# EasyEDA Pro project ProPrj_MiniFoc_AT32F435.epro, board 功率板
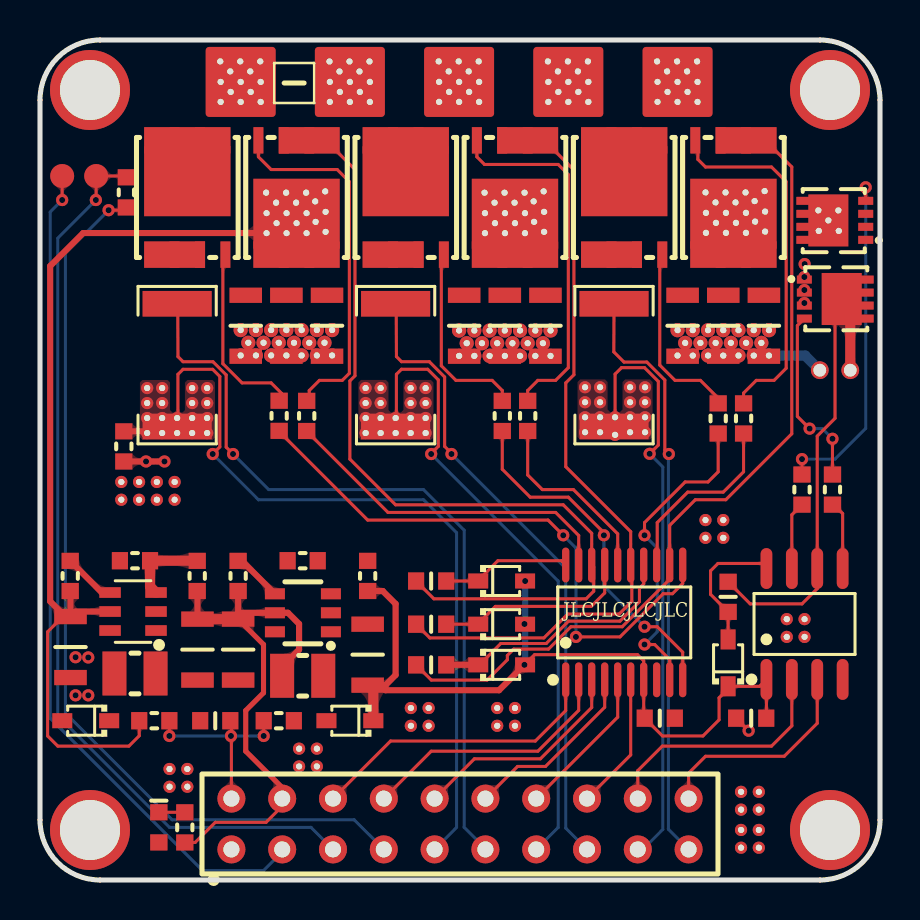
[diagram p3: board, top side]
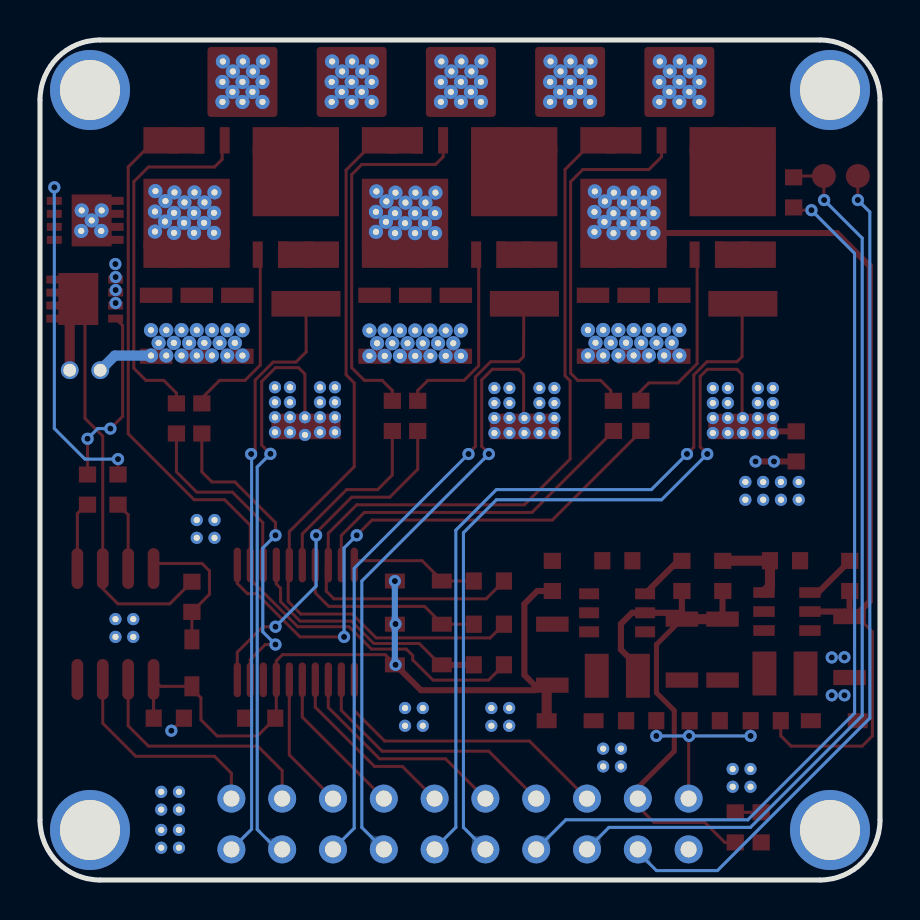
[diagram p4: board, bottom side, seen from below]

Outline 42 x 42 mm; copper layers: Top Layer, Bottom Layer. Coordinates in mm from the lower left corner of the outline.
Outline path: 0,39 0,3 arc(0.88,0.88) 3,0 39,0 arc(41.12,0.88) 42,3 42,39 arc(41.12,41.12) 39,42 3,42 arc(0.88,41.12) 0,39
Stack: Top Layer 0.035mm / Dielectric1 1.51mm FR4 er 4.5 / Bottom Layer 0.035mm

## Design rules (mm)
template: 自定义配置
spacing copperThickness1oz (default): track to track 0.127, other pairs 0 to 0.127
track width copperThickness1oz (default): min 0.127, default 0.254, max 2.54
track width copperThickness2oz: min 0.203, default 0.254, max 2.54
differential pair differentialPair (default): width min 0.127, default 0.254, max 2.54; gap min 0.152, default 0.152
via viaSize (default): diameter min 0.5, default 0.61, max 10; hole min 0.3, default 0.305, max 6.299

## Placement (name value [footprint] x y rotation side)
C2  10uF  [C0603_SMALL]  30.99 8.09 0 top
C3  1uF  [C0603_SMALL]  19.56 10.76 0 top
C4  22uF  [C1206_SMALL]  16.38 11.27 270 top
C5  22uF  [C1206_SMALL]  9.91 11.52 90 top
C8  10uF  [C1206_SMALL]  12.32 27.71 90 top
C9  1uF  [C0603_SMALL]  8.76 7.96 0 top
C11  1uF  [C0603_SMALL]  19.56 14.95 0 top
C12  1uF  [C0603_SMALL]  19.56 12.79 0 top
C20  10uF  [C1206_SMALL]  7.87 11.52 90 top
C25  10uF  [C1206_SMALL]  10.29 27.71 90 top
C27  4.7uF  [C1206_SMALL]  1.52 11.65 90 top
C28  10uF  [C1206_SMALL]  34.16 27.71 90 top
C29  1uF  [C0603_SMALL]  34.41 14.16 270 top
C30  0.1uF  [C0603_SMALL]  35.56 8.09 180 top
C31  10uF  [C1206_SMALL]  25.27 27.71 90 top
C32  10uF  [C1206_SMALL]  36.19 27.71 90 top
C33  10uF  [C1206_SMALL]  14.35 27.71 90 top
C34  10uF  [C1206_SMALL]  32.13 27.71 90 top
C35  10uF  [C1206_SMALL]  23.24 27.71 90 top
C36  10uF  [C1206_SMALL]  21.21 27.71 90 top
D2  1N5819WS  [SOD-323_L1.8-W1.3-LS2.5-RD]  23.08 12.79 0 top
D3  1N5819WS  [SOD-323_L1.8-W1.3-LS2.5-RD]  23.08 14.95 0 top
D5  1N5819WS  [SOD-323_L1.8-W1.3-LS2.5-RD]  23.08 10.76 0 top
D6  1N5819WS  [SOD-323_L1.8-W1.3-LS2.5-RD]  15.49 7.96 180 top
D7  1N5819WS  [SOD-323_L1.8-W1.3-LS2.5-RD]  2.29 7.96 180 top
D8  1N5819WS  [SOD-323_L1.8-W1.3-LS2.5-RD]  34.41 10.86 90 top
L1  10uH  [IND-SMD_L2.5-W2.0]  13.13 10.21 180 top
L2  10uH  [IND-SMD_L2.5-W2.0]  4.75 10.33 180 top
LED2  NCD0603B1  [LED0603_RED_SMALL]  5.94 2.63 270 top
NOREF  -  [Pad_e977]  10.03 38.9 0 top
NOREF#2  -  [Pad_e147]  12.95 5.68 0 top
NOREF#3  -  [Pad_e574]  7.61 22.35 0 top
NOREF#4  -  [Pad_e166]  22.86 7.71 0 top
NOREF#5  -  [Pad_e845]  14.28 33.41 0 top
NOREF#6  -  [Pad_e185]  33.27 17.11 0 top
NOREF#7  -  [Pad_e883]  34.28 34.38 0 top
NOREF#8  -  [Pad_e838]  12.33 32.34 0 top
NOREF#9  -  [Pad_e1525]  36.45 27.49 0 top
NOREF#10  -  [Pad_e971]  10.01 40.93 0 top
NOREF#11  -  [Pad_e693]  29.5 24.64 0 top
NOREF#12  -  [Pad_e150]  19.43 8.6 0 top
NOREF#13  -  [Pad_e989]  14.49 38.91 0 top
NOREF#14  -  [Pad_e1030]  32.36 40.43 0 top
NOREF#15  -  [Pad_e1523]  34.93 26.22 0 top
NOREF#16  -  [Pad_e179]  38.23 13.04 0 top
NOREF#17  -  [Pad_e151]  18.54 7.71 0 top
NOREF#18  -  [Pad_e716]  28.75 23.14 0 top
NOREF#19  -  [Pad_e495]  2.5 2.5 180 top
NOREF#20  -  [Pad_e125]  4.95 19.9 0 top
NOREF#21  -  [Pad_e837]  13.33 32.34 0 top
NOREF#22  -  [Pad_e2079]  39.92 33.48 0 top
NOREF#23  -  [Pad_e1500]  24 27.47 0 top
NOREF#24  -  [Pad_e638]  17.03 24.6 0 top
NOREF#25  -  [Pad_e867]  25.18 34.43 0 top
NOREF#26  -  [Pad_e853]  24.7 32.91 0 top
NOREF#27  -  [Pad_e878]  33.8 32.86 0 top
NOREF#28  -  [Pad_e134]  6.48 4.66 0 top
NOREF#29  -  [Pad_e1489]  21.72 27.47 0 top
NOREF#30  -  [Pad_e839]  12.83 32.84 0 top
NOREF#31  -  [Pad_e623]  17.78 22.35 0 top
NOREF#32  -  [Pad_e2076]  39.42 32.98 0 top
NOREF#33  -  [Pad_e1513]  31.88 26.22 0 top
NOREF#34  -  [Pad_e835]  13.78 32.91 0 top
NOREF#35  -  [Pad_e1021]  27.42 38.9 0 top
NOREF#36  -  [Pad_e625]  16.28 22.35 0 top
NOREF#37  -  [Pad_e1522]  35.31 26.86 0 top
NOREF#38  -  [Pad_e1484]  13.84 27.5 0 top
NOREF#39  -  [Pad_e1009]  25.39 40.93 0 top
NOREF#40  -  [Pad_e632]  16.28 23.85 0 top
NOREF#41  -  [Pad_e177]  35.94 1.61 0 top
NOREF#42  -  [Pad_e854]  25.2 32.41 0 top
NOREF#43  -  [Pad_e1518]  33.78 26.86 0 top
NOREF#44  -  [Pad_e852]  12.8 33.87 0 top
NOREF#45  -  [Pad_e133]  7.37 5.55 0 top
NOREF#46  -  [Pad_e182]  33.27 18 0 top
NOREF#47  -  [Pad_e1003]  20.96 38.9 0 top
NOREF#48  -  [Pad_e993]  16.47 40.93 0 top
NOREF#49  -  [Pad_e1029]  31.88 38.9 0 top
NOREF#50  -  [Pad_e1016]  26.42 38.9 0 top
NOREF#51  -  [Pad_e841]  12.33 33.34 0 top
NOREF#52  -  [Pad_e858]  24.25 33.34 0 top
NOREF#53  -  [Pad_e874]  34.3 32.36 0 top
NOREF#54  -  [Pad_e631]  19.28 23.85 0 top
NOREF#55  -  [Pad_e872]  36.25 32.42 0 top
NOREF#56  -  [Pad_e860]  22.75 32.84 0 top
NOREF#57  -  [Pad_e494]  39.5 2.5 180 top
NOREF#58  -  [Pad_e1498]  22.86 26.84 0 top
NOREF#59  -  [Pad_e1005]  21.46 39.4 0 top
NOREF#60  -  [Pad_e500]  20.96 39.9 0 top
NOREF#61  -  [Pad_e493]  39.5 39.5 180 top
NOREF#62  -  [Pad_e169]  35.05 4.41 0 top
NOREF#63  -  [Pad_e719]  28 24.64 0 top
NOREF#64  -  [Pad_e857]  23.75 32.84 0 top
NOREF#65  -  [Pad_e861]  22.25 32.34 0 top
NOREF#66  -  [Pad_e1507]  24.76 26.2 0 top
NOREF#67  -  [Pad_e637]  16.28 24.6 0 top
NOREF#68  -  [Pad_e698]  30.25 22.39 0 top
NOREF#69  -  [Pad_e629]  18.53 23.1 0 top
NOREF#70  -  [Pad_e127]  4.95 19.01 0 top
NOREF#71  -  [Pad_e592]  6.11 24.6 0 top
NOREF#72  -  [Pad_e1519]  34.16 26.22 0 top
NOREF#73  -  [Pad_e864]  24.23 34.37 0 top
NOREF#74  -  [Pad_e697]  30.25 23.89 0 top
NOREF#75  -  [Pad_e1520]  34.93 27.49 0 top
NOREF#76  -  [Pad_e1015]  25.42 38.91 0 top
NOREF#77  -  [Pad_e1023]  31.86 40.93 0 top
NOREF#78  -  [Pad_e636]  18.53 24.6 0 top
NOREF#79  -  [Pad_e1494]  21.72 26.2 0 top
NOREF#80  -  [Pad_e884]  33.28 34.38 0 top
NOREF#81  -  [Pad_e627]  18.53 22.35 0 top
NOREF#82  -  [Pad_e132]  6.48 5.55 0 top
NOREF#83  -  [Pad_e973]  9.03 39.91 0 top
NOREF#84  -  [Pad_e871]  35.75 32.92 0 top
NOREF#85  -  [Pad_e851]  13.76 33.93 0 top
NOREF#86  -  [Pad_e167]  23.75 7.71 0 top
NOREF#87  -  [Pad_e983]  14.47 40.93 0 top
NOREF#88  -  [Pad_e1472]  11.18 26.86 0 top
NOREF#89  -  [Pad_e1476]  11.56 27.5 0 top
NOREF#90  -  [Pad_e869]  24.68 33.93 0 top
NOREF#91  -  [Pad_e1477]  12.32 27.5 0 top
NOREF#92  -  [Pad_e1018]  26.92 39.4 0 top
NOREF#93  -  [Pad_e1011]  25.89 40.43 0 top
NOREF#94  -  [Pad_e1503]  24 26.2 0 top
NOREF#95  -  [Pad_e1479]  12.32 26.23 0 top
NOREF#96  -  [Pad_e152]  19.43 7.71 0 top
NOREF#97  -  [Pad_e715]  27.25 23.14 0 top
NOREF#98  -  [Pad_e877]  34.3 33.36 0 top
NOREF#99  -  [Pad_e880]  33.3 33.36 0 top
NOREF#100  -  [Pad_e988]  14.99 39.4 0 top
NOREF#101  -  [Pad_e171]  35.94 4.41 0 top
NOREF#102  -  [Pad_e1471]  10.41 26.86 0 top
NOREF#103  -  [Pad_e1001]  20.46 39.4 0 top
NOREF#104  -  [Pad_e1013]  26.42 39.9 0 top
NOREF#105  -  [Pad_e1495]  22.48 26.2 0 top
NOREF#106  -  [Pad_e176]  35.05 1.61 0 top
NOREF#107  -  [Pad_e1528]  36.45 26.22 0 top
NOREF#108  -  [Pad_e1527]  35.69 26.22 0 top
NOREF#109  -  [Pad_e628]  17.03 23.1 0 top
NOREF#110  -  [Pad_e696]  30.25 24.64 0 top
NOREF#111  -  [Pad_e1007]  21.96 39.9 0 top
NOREF#112  -  [Pad_e149]  18.54 8.6 0 top
NOREF#113  -  [Pad_e619]  17.78 23.1 0 top
NOREF#114  -  [Pad_e987]  15.49 39.9 0 top
NOREF#115  -  [Pad_e710]  27.25 23.89 0 top
NOREF#116  -  [Pad_e712]  28.75 22.26 0 top
NOREF#117  -  [Pad_e981]  11.03 39.9 0 top
NOREF#118  -  [Pad_e1517]  34.16 27.49 0 top
NOREF#119  -  [Pad_e711]  28 23.89 0 top
NOREF#120  -  [Pad_e994]  16.49 39.9 0 top
NOREF#121  -  [Pad_e836]  14.28 32.41 0 top
NOREF#122  -  [Pad_e633]  18.53 23.85 0 top
NOREF#123  -  [Pad_e1470]  10.03 27.5 0 top
NOREF#124  -  [Pad_e843]  11.33 32.34 0 top
NOREF#125  -  [Pad_e2078]  39.94 32.45 0 top
NOREF#126  -  [Pad_e1006]  21.93 40.93 0 top
NOREF#127  -  [Pad_e984]  15.47 40.93 0 top
NOREF#128  -  [Pad_e1508]  25.53 26.2 0 top
NOREF#129  -  [Pad_e1031]  32.38 39.4 0 top
NOREF#130  -  [Pad_e501]  15.49 39.9 180 top
NOREF#131  -  [Pad_e178]  37.34 13.04 0 top
NOREF#132  -  [Pad_e162]  23.75 8.6 0 top
NOREF#133  -  [Pad_e617]  16.28 23.1 0 top
NOREF#134  -  [Pad_e1707]  40.51 25.49 0 top
NOREF#135  -  [Pad_e148]  13.84 5.68 0 top
NOREF#136  -  [Pad_e1024]  31.36 40.43 0 top
NOREF#137  -  [Pad_e1496]  22.48 27.47 0 top
NOREF#138  -  [Pad_e976]  9.03 38.91 0 top
NOREF#139  -  [Pad_e846]  13.31 34.37 0 top
NOREF#140  -  [Pad_e694]  29.5 22.39 0 top
NOREF#141  -  [Pad_e1493]  20.96 26.2 0 top
NOREF#142  -  [Pad_e572]  5.36 22.35 0 top
NOREF#143  -  [Pad_e499]  26.42 39.9 180 top
NOREF#144  -  [Pad_e996]  19.93 40.93 0 top
NOREF#145  -  [Pad_e1000]  20.96 39.9 0 top
NOREF#146  -  [Pad_e1516]  33.4 27.49 0 top
NOREF#147  -  [Pad_e1028]  30.88 38.91 0 top
NOREF#148  -  [Pad_e129]  6.73 19.9 0 top
NOREF#149  -  [Pad_e576]  7.61 23.1 0 top
NOREF#150  -  [Pad_e1502]  24.38 26.84 0 top
NOREF#151  -  [Pad_e593]  8.36 24.6 0 top
NOREF#152  -  [Pad_e1705]  38.99 25.49 0 top
NOREF#153  -  [Pad_e639]  19.28 24.6 0 top
NOREF#154  -  [Pad_e183]  34.16 18 0 top
NOREF#155  -  [Pad_e130]  5.84 19.01 0 top
NOREF#156  -  [Pad_e1033]  32.88 39.9 0 top
NOREF#157  -  [Pad_e1022]  30.86 40.93 0 top
NOREF#158  -  [Pad_e1034]  32.88 38.9 0 top
NOREF#159  -  [Pad_e590]  7.61 24.6 0 top
NOREF#160  -  [Pad_e717]  28 23.14 0 top
NOREF#161  -  [Pad_e566]  6.86 23.1 0 top
NOREF#162  -  [Pad_e1025]  30.88 39.91 0 top
NOREF#163  -  [Pad_e1012]  25.42 39.91 0 top
NOREF#164  -  [Pad_e186]  34.16 17.11 0 top
NOREF#165  -  [Pad_e585]  8.36 23.85 0 top
NOREF#166  -  [Pad_e1002]  19.95 38.91 0 top
NOREF#167  -  [Pad_e1488]  14.6 26.23 0 top
NOREF#168  -  [Pad_e995]  16.49 38.9 0 top
NOREF#169  -  [Pad_e699]  30.25 23.14 0 top
NOREF#170  -  [Pad_e1020]  27.42 39.9 0 top
NOREF#171  -  [Pad_e1487]  13.84 26.23 0 top
NOREF#172  -  [Pad_e1526]  36.07 26.86 0 top
NOREF#173  -  [Pad_e1491]  21.34 26.84 0 top
NOREF#174  -  [Pad_e1492]  22.1 26.84 0 top
NOREF#175  -  [Pad_e1509]  32.64 27.49 0 top
NOREF#176  -  [Pad_e863]  25.2 33.41 0 top
NOREF#177  -  [Pad_e1483]  13.08 26.23 0 top
NOREF#178  -  [Pad_e618]  19.28 23.1 0 top
NOREF#179  -  [Pad_e888]  34.78 33.88 0 top
NOREF#180  -  [Pad_e997]  20.93 40.93 0 top
NOREF#181  -  [Pad_e865]  23.23 34.37 0 top
NOREF#182  -  [Pad_e2075]  38.92 33.48 0 top
NOREF#183  -  [Pad_e571]  6.11 22.35 0 top
NOREF#184  -  [Pad_e980]  11.01 40.93 0 top
NOREF#185  -  [Pad_e175]  35.94 2.5 0 top
NOREF#186  -  [Pad_e998]  20.43 40.43 0 top
NOREF#187  -  [Pad_e492]  2.5 39.5 180 top
NOREF#188  -  [Pad_e870]  23.73 33.87 0 top
NOREF#189  -  [Pad_e881]  36.25 33.42 0 top
NOREF#190  -  [Pad_e859]  23.25 33.34 0 top
NOREF#191  -  [Pad_e575]  6.11 23.1 0 top
NOREF#192  -  [Pad_e1019]  27.39 40.93 0 top
NOREF#193  -  [Pad_e1524]  35.69 27.49 0 top
NOREF#194  -  [Pad_e849]  14.26 34.43 0 top
NOREF#195  -  [Pad_e1505]  25.53 27.47 0 top
NOREF#196  -  [Pad_e887]  35.73 33.94 0 top
NOREF#197  -  [Pad_e1506]  25.15 26.84 0 top
NOREF#198  -  [Pad_e886]  33.78 33.88 0 top
NOREF#199  -  [Pad_e1469]  10.79 27.5 0 top
NOREF#200  -  [Pad_e1481]  12.7 26.86 0 top
NOREF#201  -  [Pad_e985]  14.97 40.43 0 top
NOREF#202  -  [Pad_e2077]  38.94 32.45 0 top
NOREF#203  -  [Pad_e879]  33.3 32.36 0 top
NOREF#204  -  [Pad_e128]  5.84 19.9 0 top
NOREF#205  -  [Pad_e180]  37.34 12.16 0 top
NOREF#206  -  [Pad_e999]  19.95 39.91 0 top
NOREF#207  -  [Pad_e862]  22.25 33.34 0 top
NOREF#208  -  [Pad_e855]  24.25 32.34 0 top
NOREF#209  -  [Pad_e498]  10.03 39.9 0 top
NOREF#210  -  [Pad_e174]  35.05 2.5 0 top
NOREF#211  -  [Pad_e1504]  24.76 27.47 0 top
NOREF#212  -  [Pad_e1511]  32.26 26.86 0 top
NOREF#213  -  [Pad_e587]  7.61 23.85 0 top
NOREF#214  -  [Pad_e140]  12.95 6.57 0 top
NOREF#215  -  [Pad_e873]  35.3 32.36 0 top
NOREF#216  -  [Pad_e974]  10.03 39.9 0 top
NOREF#217  -  [Pad_e970]  9.01 40.93 0 top
NOREF#218  -  [Pad_e564]  5.36 23.1 0 top
NOREF#219  -  [Pad_e161]  22.86 8.6 0 top
NOREF#220  -  [Pad_e588]  6.11 23.85 0 top
NOREF#221  -  [Pad_e1514]  32.64 26.22 0 top
NOREF#222  -  [Pad_e1485]  14.6 27.5 0 top
NOREF#223  -  [Pad_e982]  11.03 38.9 0 top
NOREF#224  -  [Pad_e844]  11.33 33.34 0 top
NOREF#225  -  [Pad_e124]  4.06 19.9 0 top
NOREF#226  -  [Pad_e1004]  21.43 40.43 0 top
NOREF#227  -  [Pad_e986]  14.49 39.91 0 top
NOREF#228  -  [Pad_e714]  28 22.39 0 top
NOREF#229  -  [Pad_e992]  15.99 39.4 0 top
NOREF#230  -  [Pad_e135]  7.37 4.66 0 top
NOREF#231  -  [Pad_e502]  31.88 39.9 0 top
NOREF#232  -  [Pad_e1499]  23.24 26.2 0 top
NOREF#233  -  [Pad_e972]  9.51 40.43 0 top
NOREF#234  -  [Pad_e172]  35.05 3.52 0 top
NOREF#235  -  [Pad_e1032]  32.86 40.93 0 top
NOREF#236  -  [Pad_e1017]  26.89 40.43 0 top
NOREF#237  -  [Pad_e979]  10.53 39.4 0 top
NOREF#238  -  [Pad_e565]  8.36 23.1 0 top
NOREF#239  -  [Pad_e840]  13.33 33.34 0 top
NOREF#240  -  [Pad_e624]  17.03 22.35 0 top
NOREF#241  -  [Pad_e1027]  31.38 39.4 0 top
NOREF#242  -  [Pad_e876]  35.3 33.36 0 top
NOREF#243  -  [Pad_e975]  9.53 39.4 0 top
NOREF#244  -  [Pad_e868]  22.73 33.87 0 top
NOREF#245  -  [Pad_e1475]  11.56 26.23 0 top
NOREF#246  -  [Pad_e573]  8.36 22.35 0 top
NOREF#247  -  [Pad_e718]  27.25 24.64 0 top
NOREF#248  -  [Pad_e1014]  25.92 39.4 0 top
NOREF#249  -  [Pad_e1490]  20.96 27.47 0 top
NOREF#250  -  [Pad_e692]  29.5 23.14 0 top
NOREF#251  -  [Pad_e866]  22.23 34.37 0 top
NOREF#252  -  [Pad_e1010]  26.39 40.93 0 top
NOREF#253  -  [Pad_e1480]  13.08 27.5 0 top
NOREF#254  -  [Pad_e1474]  10.79 26.23 0 top
NOREF#255  -  [Pad_e850]  11.8 33.87 0 top
NOREF#256  -  [Pad_e842]  11.83 32.84 0 top
NOREF#257  -  [Pad_e882]  35.28 34.38 0 top
NOREF#258  -  [Pad_e1473]  10.03 26.23 0 top
NOREF#259  -  [Pad_e131]  6.73 19.01 0 top
NOREF#260  -  [Pad_e1486]  14.22 26.86 0 top
NOREF#261  -  [Pad_e591]  5.36 24.6 0 top
NOREF#262  -  [Pad_e875]  34.8 32.86 0 top
NOREF#263  -  [Pad_e848]  11.3 34.37 0 top
NOREF#264  -  [Pad_e173]  35.94 3.52 0 top
NOREF#265  -  [Pad_e570]  6.86 22.35 0 top
NOREF#266  -  [Pad_e1482]  13.46 26.86 0 top
NOREF#267  -  [Pad_e126]  4.06 19.01 0 top
NOREF#268  -  [Pad_e856]  23.25 32.34 0 top
NOREF#269  -  [Pad_e885]  36.23 34.44 0 top
NOREF#270  -  [Pad_e991]  15.97 40.43 0 top
NOREF#271  -  [Pad_e695]  29.5 23.89 0 top
NOREF#272  -  [Pad_e978]  10.51 40.43 0 top
NOREF#273  -  [Pad_e1501]  23.62 26.84 0 top
NOREF#274  -  [Pad_e1497]  23.24 27.47 0 top
NOREF#275  -  [Pad_e145]  13.84 6.57 0 top
NOREF#276  -  [Pad_e1512]  33.02 26.86 0 top
NOREF#277  -  [Pad_e1478]  11.94 26.86 0 top
NOREF#278  -  [Pad_e1026]  31.88 39.9 0 top
NOREF#279  -  [Pad_e1521]  34.54 26.86 0 top
NOREF#280  -  [Pad_e626]  19.28 22.35 0 top
NOREF#281  -  [Pad_e1008]  21.96 38.9 0 top
NOREF#282  -  [Pad_e990]  15.49 38.9 0 top
NOREF#283  -  [Pad_e181]  38.23 12.16 0 top
NOREF#284  -  [Pad_e713]  27.25 22.39 0 top
NOREF#285  -  [Pad_e1510]  31.88 27.49 0 top
NOREF#286  -  [Pad_e1515]  33.4 26.22 0 top
NOREF#287  -  [Pad_e847]  12.31 34.37 0 top
NOREF#288  -  [Pad_e634]  17.03 23.85 0 top
NOREF#289  -  [Pad_e586]  5.36 23.85 0 top
Q7  KNY3406C  [PDFNWB-8L_L6.0-W5.0-P1.27-BL-EP_CON]  34.67 34.13 180 top
Q8  KNY3406C  [PDFNWB-8L_L6.0-W5.0-P1.27-BL-EP_CON]  23.75 34.13 180 top
Q9  KNY3406C  [PDFNWB-8L_L6.0-W5.0-P1.27-BL-EP_CON]  12.83 34.13 180 top
Q10  KNY3406C  [PDFNWB-8L_L6.0-W5.0-P1.27-BL-EP_CON]  29.21 34.13 0 top
Q11  KNY3406C  [PDFNWB-8L_L6.0-W5.0-P1.27-BL-EP_CON]  18.29 34.13 0 top
Q12  KNY3406C  [PDFNWB-8L_L6.0-W5.0-P1.27-BL-EP_CON]  7.37 34.13 0 top
Q15  WSD4070DN  [PDFN3333-8_L3.1-W3.2-P0.65-LS3.4-BL]  39.75 32.98 90 top
Q16  WSD4070DN  [PDFN3333-8_L3.1-W3.2-P0.65-LS3.4-BL]  39.75 29.05 270 top
R1  10kΩ  [R0603_SMALL]  5.72 7.96 0 top
R2  5mΩ  [R2512]  6.86 25.74 90 top
R3  5mΩ  [R2512]  17.78 25.74 90 top
R5  100kΩ  [R0603_SMALL]  16.38 15.2 90 top
R6  1kΩ  [R0603_SMALL]  7.24 2.63 90 top
R7  10Ω  [R0603_SMALL]  35.18 23.08 90 top
R8  1kΩ  [R0603_SMALL]  11.94 7.96 0 top
R11  10Ω  [R0603_SMALL]  33.91 23.08 90 top
R14  5mΩ  [R2512]  28.7 25.74 90 top
R19  10Ω  [R0603_SMALL]  24.38 23.2 90 top
R22  10Ω  [R0603_SMALL]  23.11 23.2 90 top
R23  10Ω  [R0603_SMALL]  13.33 23.2 90 top
R24  10Ω  [R0603_SMALL]  11.96 23.21 90 top
R25  5.1kΩ  [R0603_SMALL]  13.13 15.96 180 top
R26  10kΩ  [R0603_SMALL]  4.75 15.96 180 top
R27  52.3kΩ  [R0603_SMALL]  7.86 15.2 90 top
R28  10kΩ  [R0603_SMALL]  9.91 15.2 90 top
R29  10kΩ  [R0603_SMALL]  1.51 15.2 90 top
R61  0Ω  [R0603_SMALL]  4.19 21.68 270 top
R62  10Ω  [R0603_SMALL]  38.1 19.52 90 top
R63  10Ω  [R0603_SMALL]  39.62 19.52 90 top
RT1  TCTR0603F10K0F3930T  [R0603_SMALL]  4.32 34.38 90 top
TP5  Testpoint 1.6mm  [TESTPOINT 1.6MM]  1.11 35.2 0 top
TP6  Testpoint 1.6mm  [TESTPOINT 1.6MM]  2.81 35.2 0 top
U1  FD6288T  [TSSOP-20_L6.5-W4.4-P0.65-LS6.4-BL]  29.21 12.88 0 top
U14  MT3608  [SOT-23-6_L2.9-W1.6-P0.95-LS2.8-BR]  13.15 13.36 0 top
U15  TX4137  [SOT-23-6_L2.9-W1.6-P0.95-LS2.8-BL]  4.65 13.42 90 top
U19  MF254V-12-20-0743  [HDR-TH_20P-P2.54-V-F-R2-C10-S2.54-3]  21 2.8 0 top
U20  EG3112  [SOIC-8_L4.9-W3.9-P1.27-LS6.0-BL]  38.23 12.8 0 top

## Footprints (pads in the part's own frame, mm; a bottom-side part is the same pattern mirrored in y, then rotated)
C0603_SMALL
  rect 0.806x0.864 smd: 1(-0.753,0) 2(0.753,0)
C1206_SMALL
  rect 0.762x1.625 smd: 1(-1.524,0) 2(1.524,0)
HDR-TH_20P-P2.54-V-F-R2-C10-S2.54-3
  round 1.4 hole 0.8: 1(-11.43,-1.27) 2(-11.43,1.27) 3(-8.89,-1.27) 4(-8.89,1.27) 5(-6.35,-1.27) 6(-6.35,1.27) 7(-3.81,-1.27) 8(-3.81,1.27) 9(-1.27,-1.27) 10(-1.27,1.27) 11(1.27,-1.27) 12(1.27,1.27) 13(3.81,-1.27) 14(3.81,1.27) 15(6.35,-1.27) 16(6.35,1.27) 17(8.89,-1.27) 18(8.89,1.27) 19(11.43,-1.27) 20(11.43,1.27)
IND-SMD_L2.5-W2.0
  rect 1.199x2.2 smd: 1(1.028,0) 2(-1.028,0)
LED0603_RED_SMALL
  rect 0.806x0.864 smd: 1(0.753,0) 2(-0.753,0)
Pad_e124
  round 0.61 hole 0.31x0.305: (0,0)
Pad_e125
  round 0.61 hole 0.31x0.305: (0,0)
Pad_e126
  round 0.61 hole 0.31x0.305: (0,0)
Pad_e127
  round 0.61 hole 0.31x0.305: (0,0)
Pad_e128
  round 0.61 hole 0.31x0.305: (0,0)
Pad_e129
  round 0.61 hole 0.31x0.305: (0,0)
Pad_e130
  round 0.61 hole 0.31x0.305: (0,0)
Pad_e131
  round 0.61 hole 0.31x0.305: (0,0)
Pad_e132
  round 0.61 hole 0.31x0.305: (0,0)
Pad_e133
  round 0.61 hole 0.31x0.305: (0,0)
Pad_e134
  round 0.61 hole 0.31x0.305: (0,0)
Pad_e135
  round 0.61 hole 0.31x0.305: (0,0)
Pad_e140
  round 0.61 hole 0.31x0.305: (0,0)
Pad_e145
  round 0.61 hole 0.31x0.305: (0,0)
Pad_e147
  round 0.61 hole 0.31x0.305: (0,0)
Pad_e148
  round 0.61 hole 0.31x0.305: (0,0)
Pad_e149
  round 0.61 hole 0.31x0.305: (0,0)
Pad_e150
  round 0.61 hole 0.31x0.305: (0,0)
Pad_e151
  round 0.61 hole 0.31x0.305: (0,0)
Pad_e152
  round 0.61 hole 0.31x0.305: (0,0)
Pad_e161
  round 0.61 hole 0.31x0.305: (0,0)
Pad_e162
  round 0.61 hole 0.31x0.305: (0,0)
Pad_e166
  round 0.61 hole 0.31x0.305: (0,0)
Pad_e167
  round 0.61 hole 0.31x0.305: (0,0)
Pad_e169
  round 0.61 hole 0.31x0.305: (0,0)
Pad_e171
  round 0.61 hole 0.31x0.305: (0,0)
Pad_e172
  round 0.61 hole 0.31x0.305: (0,0)
Pad_e173
  round 0.61 hole 0.31x0.305: (0,0)
Pad_e174
  round 0.61 hole 0.31x0.305: (0,0)
Pad_e175
  round 0.61 hole 0.31x0.305: (0,0)
Pad_e176
  round 0.61 hole 0.31x0.305: (0,0)
Pad_e177
  round 0.61 hole 0.31x0.305: (0,0)
Pad_e178
  round 0.61 hole 0.31x0.305: (0,0)
Pad_e179
  round 0.61 hole 0.31x0.305: (0,0)
Pad_e180
  round 0.61 hole 0.31x0.305: (0,0)
Pad_e181
  round 0.61 hole 0.31x0.305: (0,0)
Pad_e182
  round 0.61 hole 0.31x0.305: (0,0)
Pad_e183
  round 0.61 hole 0.31x0.305: (0,0)
Pad_e185
  round 0.61 hole 0.31x0.305: (0,0)
Pad_e186
  round 0.61 hole 0.31x0.305: (0,0)
Pad_e492
  round 4 hole 3: 1(0,0)
Pad_e493
  round 4 hole 3.005x3: 1(0,0)
Pad_e494
  round 4 hole 3.005x3: 1(0,0)
Pad_e495
  round 4 hole 3.005x3: 1(0,0)
Pad_e498
  rrect 3.5x3.5 smd: 21(0,0)
Pad_e499
  rrect 3.5x3.5 smd: 21(0,0)
Pad_e500
  rrect 3.5x3.5 smd: 21(0,0)
Pad_e501
  rrect 3.5x3.5 smd: 21(0,0)
Pad_e502
  rrect 3.5x3.5 smd: 21(0,0)
Pad_e564
  round 0.61 hole 0.31x0.305: (0,0)
Pad_e565
  round 0.61 hole 0.31x0.305: (0,0)
Pad_e566
  round 0.61 hole 0.31x0.305: (0,0)
Pad_e570
  round 0.61 hole 0.31x0.305: (0,0)
Pad_e571
  round 0.61 hole 0.31x0.305: (0,0)
Pad_e572
  round 0.61 hole 0.31x0.305: (0,0)
Pad_e573
  round 0.61 hole 0.31x0.305: (0,0)
Pad_e574
  round 0.61 hole 0.31x0.305: (0,0)
Pad_e575
  round 0.61 hole 0.31x0.305: (0,0)
Pad_e576
  round 0.61 hole 0.31x0.305: (0,0)
Pad_e585
  round 0.61 hole 0.31x0.305: (0,0)
Pad_e586
  round 0.61 hole 0.31x0.305: (0,0)
Pad_e587
  round 0.61 hole 0.31x0.305: (0,0)
Pad_e588
  round 0.61 hole 0.31x0.305: (0,0)
Pad_e590
  round 0.61 hole 0.31x0.305: (0,0)
Pad_e591
  round 0.61 hole 0.31x0.305: (0,0)
Pad_e592
  round 0.61 hole 0.31x0.305: (0,0)
Pad_e593
  round 0.61 hole 0.31x0.305: (0,0)
Pad_e617
  round 0.61 hole 0.31x0.305: (0,0)
Pad_e618
  round 0.61 hole 0.31x0.305: (0,0)
Pad_e619
  round 0.61 hole 0.31x0.305: (0,0)
Pad_e623
  round 0.61 hole 0.31x0.305: (0,0)
Pad_e624
  round 0.61 hole 0.31x0.305: (0,0)
Pad_e625
  round 0.61 hole 0.31x0.305: (0,0)
Pad_e626
  round 0.61 hole 0.31x0.305: (0,0)
Pad_e627
  round 0.61 hole 0.31x0.305: (0,0)
Pad_e628
  round 0.61 hole 0.31x0.305: (0,0)
Pad_e629
  round 0.61 hole 0.31x0.305: (0,0)
Pad_e631
  round 0.61 hole 0.31x0.305: (0,0)
Pad_e632
  round 0.61 hole 0.31x0.305: (0,0)
Pad_e633
  round 0.61 hole 0.31x0.305: (0,0)
Pad_e634
  round 0.61 hole 0.31x0.305: (0,0)
Pad_e636
  round 0.61 hole 0.31x0.305: (0,0)
Pad_e637
  round 0.61 hole 0.31x0.305: (0,0)
Pad_e638
  round 0.61 hole 0.31x0.305: (0,0)
Pad_e639
  round 0.61 hole 0.31x0.305: (0,0)
Pad_e692
  round 0.61 hole 0.31x0.305: (0,0)
Pad_e693
  round 0.61 hole 0.31x0.305: (0,0)
Pad_e694
  round 0.61 hole 0.31x0.305: (0,0)
Pad_e695
  round 0.61 hole 0.31x0.305: (0,0)
Pad_e696
  round 0.61 hole 0.31x0.305: (0,0)
Pad_e697
  round 0.61 hole 0.31x0.305: (0,0)
Pad_e698
  round 0.61 hole 0.31x0.305: (0,0)
Pad_e699
  round 0.61 hole 0.31x0.305: (0,0)
Pad_e710
  round 0.61 hole 0.31x0.305: (0,0)
Pad_e711
  round 0.61 hole 0.31x0.305: (0,0)
Pad_e712
  round 0.61 hole 0.31x0.305: (0,0)
Pad_e713
  round 0.61 hole 0.31x0.305: (0,0)
Pad_e714
  round 0.61 hole 0.31x0.305: (0,0)
Pad_e715
  round 0.61 hole 0.31x0.305: (0,0)
Pad_e716
  round 0.61 hole 0.31x0.305: (0,0)
Pad_e717
  round 0.61 hole 0.31x0.305: (0,0)
Pad_e718
  round 0.61 hole 0.31x0.305: (0,0)
Pad_e719
  round 0.61 hole 0.31x0.305: (0,0)
Pad_e835
  round 0.711 hole 0.31x0.305: (0,0)
Pad_e836
  round 0.711 hole 0.31x0.305: (0,0)
Pad_e837
  round 0.711 hole 0.31x0.305: (0,0)
Pad_e838
  round 0.711 hole 0.31x0.305: (0,0)
Pad_e839
  round 0.711 hole 0.31x0.305: (0,0)
Pad_e840
  round 0.711 hole 0.31x0.305: (0,0)
Pad_e841
  round 0.711 hole 0.31x0.305: (0,0)
Pad_e842
  round 0.711 hole 0.31x0.305: (0,0)
Pad_e843
  round 0.711 hole 0.31x0.305: (0,0)
Pad_e844
  round 0.711 hole 0.31x0.305: (0,0)
Pad_e845
  round 0.711 hole 0.31x0.305: (0,0)
Pad_e846
  round 0.711 hole 0.31x0.305: (0,0)
Pad_e847
  round 0.711 hole 0.31x0.305: (0,0)
Pad_e848
  round 0.711 hole 0.31x0.305: (0,0)
Pad_e849
  round 0.711 hole 0.31x0.305: (0,0)
Pad_e850
  round 0.711 hole 0.31x0.305: (0,0)
Pad_e851
  round 0.711 hole 0.31x0.305: (0,0)
Pad_e852
  round 0.711 hole 0.31x0.305: (0,0)
Pad_e853
  round 0.711 hole 0.31x0.305: (0,0)
Pad_e854
  round 0.711 hole 0.31x0.305: (0,0)
Pad_e855
  round 0.711 hole 0.31x0.305: (0,0)
Pad_e856
  round 0.711 hole 0.31x0.305: (0,0)
Pad_e857
  round 0.711 hole 0.31x0.305: (0,0)
Pad_e858
  round 0.711 hole 0.31x0.305: (0,0)
Pad_e859
  round 0.711 hole 0.31x0.305: (0,0)
Pad_e860
  round 0.711 hole 0.31x0.305: (0,0)
Pad_e861
  round 0.711 hole 0.31x0.305: (0,0)
Pad_e862
  round 0.711 hole 0.31x0.305: (0,0)
Pad_e863
  round 0.711 hole 0.31x0.305: (0,0)
Pad_e864
  round 0.711 hole 0.31x0.305: (0,0)
Pad_e865
  round 0.711 hole 0.31x0.305: (0,0)
Pad_e866
  round 0.711 hole 0.31x0.305: (0,0)
Pad_e867
  round 0.711 hole 0.31x0.305: (0,0)
Pad_e868
  round 0.711 hole 0.31x0.305: (0,0)
Pad_e869
  round 0.711 hole 0.31x0.305: (0,0)
Pad_e870
  round 0.711 hole 0.31x0.305: (0,0)
Pad_e871
  round 0.711 hole 0.31x0.305: (0,0)
Pad_e872
  round 0.711 hole 0.31x0.305: (0,0)
Pad_e873
  round 0.711 hole 0.31x0.305: (0,0)
Pad_e874
  round 0.711 hole 0.31x0.305: (0,0)
Pad_e875
  round 0.711 hole 0.31x0.305: (0,0)
Pad_e876
  round 0.711 hole 0.31x0.305: (0,0)
Pad_e877
  round 0.711 hole 0.31x0.305: (0,0)
Pad_e878
  round 0.711 hole 0.31x0.305: (0,0)
Pad_e879
  round 0.711 hole 0.31x0.305: (0,0)
Pad_e880
  round 0.711 hole 0.31x0.305: (0,0)
Pad_e881
  round 0.711 hole 0.31x0.305: (0,0)
Pad_e882
  round 0.711 hole 0.31x0.305: (0,0)
Pad_e883
  round 0.711 hole 0.31x0.305: (0,0)
Pad_e884
  round 0.711 hole 0.31x0.305: (0,0)
Pad_e885
  round 0.711 hole 0.31x0.305: (0,0)
Pad_e886
  round 0.711 hole 0.31x0.305: (0,0)
Pad_e887
  round 0.711 hole 0.31x0.305: (0,0)
Pad_e888
  round 0.711 hole 0.31x0.305: (0,0)
Pad_e970
  round 0.711 hole 0.31x0.305: (0,0)
Pad_e971
  round 0.711 hole 0.31x0.305: (0,0)
Pad_e972
  round 0.711 hole 0.31x0.305: (0,0)
Pad_e973
  round 0.711 hole 0.31x0.305: (0,0)
Pad_e974
  round 0.711 hole 0.31x0.305: (0,0)
Pad_e975
  round 0.711 hole 0.31x0.305: (0,0)
Pad_e976
  round 0.711 hole 0.31x0.305: (0,0)
Pad_e977
  round 0.711 hole 0.31x0.305: (0,0)
Pad_e978
  round 0.711 hole 0.31x0.305: (0,0)
Pad_e979
  round 0.711 hole 0.31x0.305: (0,0)
Pad_e980
  round 0.711 hole 0.31x0.305: (0,0)
Pad_e981
  round 0.711 hole 0.31x0.305: (0,0)
Pad_e982
  round 0.711 hole 0.31x0.305: (0,0)
Pad_e983
  round 0.711 hole 0.31x0.305: (0,0)
Pad_e984
  round 0.711 hole 0.31x0.305: (0,0)
Pad_e985
  round 0.711 hole 0.31x0.305: (0,0)
Pad_e986
  round 0.711 hole 0.31x0.305: (0,0)
Pad_e987
  round 0.711 hole 0.31x0.305: (0,0)
Pad_e988
  round 0.711 hole 0.31x0.305: (0,0)
Pad_e989
  round 0.711 hole 0.31x0.305: (0,0)
Pad_e990
  round 0.711 hole 0.31x0.305: (0,0)
Pad_e991
  round 0.711 hole 0.31x0.305: (0,0)
Pad_e992
  round 0.711 hole 0.31x0.305: (0,0)
Pad_e993
  round 0.711 hole 0.31x0.305: (0,0)
Pad_e994
  round 0.711 hole 0.31x0.305: (0,0)
Pad_e995
  round 0.711 hole 0.31x0.305: (0,0)
Pad_e996
  round 0.711 hole 0.31x0.305: (0,0)
Pad_e997
  round 0.711 hole 0.31x0.305: (0,0)
Pad_e998
  round 0.711 hole 0.31x0.305: (0,0)
Pad_e999
  round 0.711 hole 0.31x0.305: (0,0)
Pad_e1000
  round 0.711 hole 0.31x0.305: (0,0)
Pad_e1001
  round 0.711 hole 0.31x0.305: (0,0)
Pad_e1002
  round 0.711 hole 0.31x0.305: (0,0)
Pad_e1003
  round 0.711 hole 0.31x0.305: (0,0)
Pad_e1004
  round 0.711 hole 0.31x0.305: (0,0)
Pad_e1005
  round 0.711 hole 0.31x0.305: (0,0)
Pad_e1006
  round 0.711 hole 0.31x0.305: (0,0)
Pad_e1007
  round 0.711 hole 0.31x0.305: (0,0)
Pad_e1008
  round 0.711 hole 0.31x0.305: (0,0)
Pad_e1009
  round 0.711 hole 0.31x0.305: (0,0)
Pad_e1010
  round 0.711 hole 0.31x0.305: (0,0)
Pad_e1011
  round 0.711 hole 0.31x0.305: (0,0)
Pad_e1012
  round 0.711 hole 0.31x0.305: (0,0)
Pad_e1013
  round 0.711 hole 0.31x0.305: (0,0)
Pad_e1014
  round 0.711 hole 0.31x0.305: (0,0)
Pad_e1015
  round 0.711 hole 0.31x0.305: (0,0)
Pad_e1016
  round 0.711 hole 0.31x0.305: (0,0)
Pad_e1017
  round 0.711 hole 0.31x0.305: (0,0)
Pad_e1018
  round 0.711 hole 0.31x0.305: (0,0)
Pad_e1019
  round 0.711 hole 0.31x0.305: (0,0)
Pad_e1020
  round 0.711 hole 0.31x0.305: (0,0)
Pad_e1021
  round 0.711 hole 0.31x0.305: (0,0)
Pad_e1022
  round 0.711 hole 0.31x0.305: (0,0)
Pad_e1023
  round 0.711 hole 0.31x0.305: (0,0)
Pad_e1024
  round 0.711 hole 0.31x0.305: (0,0)
Pad_e1025
  round 0.711 hole 0.31x0.305: (0,0)
Pad_e1026
  round 0.711 hole 0.31x0.305: (0,0)
Pad_e1027
  round 0.711 hole 0.31x0.305: (0,0)
Pad_e1028
  round 0.711 hole 0.31x0.305: (0,0)
Pad_e1029
  round 0.711 hole 0.31x0.305: (0,0)
Pad_e1030
  round 0.711 hole 0.31x0.305: (0,0)
Pad_e1031
  round 0.711 hole 0.31x0.305: (0,0)
Pad_e1032
  round 0.711 hole 0.31x0.305: (0,0)
Pad_e1033
  round 0.711 hole 0.31x0.305: (0,0)
Pad_e1034
  round 0.711 hole 0.31x0.305: (0,0)
Pad_e1469
  round 0.711 hole 0.31x0.305: (0,0)
Pad_e1470
  round 0.711 hole 0.31x0.305: (0,0)
Pad_e1471
  round 0.711 hole 0.31x0.305: (0,0)
Pad_e1472
  round 0.711 hole 0.31x0.305: (0,0)
Pad_e1473
  round 0.711 hole 0.31x0.305: (0,0)
Pad_e1474
  round 0.711 hole 0.31x0.305: (0,0)
Pad_e1475
  round 0.711 hole 0.31x0.305: (0,0)
Pad_e1476
  round 0.711 hole 0.31x0.305: (0,0)
Pad_e1477
  round 0.711 hole 0.31x0.305: (0,0)
Pad_e1478
  round 0.711 hole 0.31x0.305: (0,0)
Pad_e1479
  round 0.711 hole 0.31x0.305: (0,0)
Pad_e1480
  round 0.711 hole 0.31x0.305: (0,0)
Pad_e1481
  round 0.711 hole 0.31x0.305: (0,0)
Pad_e1482
  round 0.711 hole 0.31x0.305: (0,0)
Pad_e1483
  round 0.711 hole 0.31x0.305: (0,0)
Pad_e1484
  round 0.711 hole 0.31x0.305: (0,0)
Pad_e1485
  round 0.711 hole 0.31x0.305: (0,0)
Pad_e1486
  round 0.711 hole 0.31x0.305: (0,0)
Pad_e1487
  round 0.711 hole 0.31x0.305: (0,0)
Pad_e1488
  round 0.711 hole 0.31x0.305: (0,0)
Pad_e1489
  round 0.711 hole 0.31x0.305: (0,0)
Pad_e1490
  round 0.711 hole 0.31x0.305: (0,0)
Pad_e1491
  round 0.711 hole 0.31x0.305: (0,0)
Pad_e1492
  round 0.711 hole 0.31x0.305: (0,0)
Pad_e1493
  round 0.711 hole 0.31x0.305: (0,0)
Pad_e1494
  round 0.711 hole 0.31x0.305: (0,0)
Pad_e1495
  round 0.711 hole 0.31x0.305: (0,0)
Pad_e1496
  round 0.711 hole 0.31x0.305: (0,0)
Pad_e1497
  round 0.711 hole 0.31x0.305: (0,0)
Pad_e1498
  round 0.711 hole 0.31x0.305: (0,0)
Pad_e1499
  round 0.711 hole 0.31x0.305: (0,0)
Pad_e1500
  round 0.711 hole 0.31x0.305: (0,0)
Pad_e1501
  round 0.711 hole 0.31x0.305: (0,0)
Pad_e1502
  round 0.711 hole 0.31x0.305: (0,0)
Pad_e1503
  round 0.711 hole 0.31x0.305: (0,0)
Pad_e1504
  round 0.711 hole 0.31x0.305: (0,0)
Pad_e1505
  round 0.711 hole 0.31x0.305: (0,0)
Pad_e1506
  round 0.711 hole 0.31x0.305: (0,0)
Pad_e1507
  round 0.711 hole 0.31x0.305: (0,0)
Pad_e1508
  round 0.711 hole 0.31x0.305: (0,0)
Pad_e1509
  round 0.711 hole 0.31x0.305: (0,0)
Pad_e1510
  round 0.711 hole 0.31x0.305: (0,0)
Pad_e1511
  round 0.711 hole 0.31x0.305: (0,0)
Pad_e1512
  round 0.711 hole 0.31x0.305: (0,0)
Pad_e1513
  round 0.711 hole 0.31x0.305: (0,0)
Pad_e1514
  round 0.711 hole 0.31x0.305: (0,0)
Pad_e1515
  round 0.711 hole 0.31x0.305: (0,0)
Pad_e1516
  round 0.711 hole 0.31x0.305: (0,0)
Pad_e1517
  round 0.711 hole 0.31x0.305: (0,0)
Pad_e1518
  round 0.711 hole 0.31x0.305: (0,0)
Pad_e1519
  round 0.711 hole 0.31x0.305: (0,0)
Pad_e1520
  round 0.711 hole 0.31x0.305: (0,0)
Pad_e1521
  round 0.711 hole 0.31x0.305: (0,0)
Pad_e1522
  round 0.711 hole 0.31x0.305: (0,0)
Pad_e1523
  round 0.711 hole 0.31x0.305: (0,0)
Pad_e1524
  round 0.711 hole 0.31x0.305: (0,0)
Pad_e1525
  round 0.711 hole 0.31x0.305: (0,0)
Pad_e1526
  round 0.711 hole 0.31x0.305: (0,0)
Pad_e1527
  round 0.711 hole 0.31x0.305: (0,0)
Pad_e1528
  round 0.711 hole 0.31x0.305: (0,0)
Pad_e1705
  round 0.889 hole 0.635: 5(0,0)
Pad_e1707
  round 0.889 hole 0.635: 5(0,0)
Pad_e2075
  round 0.711 hole 0.31x0.305: (0,0)
Pad_e2076
  round 0.711 hole 0.31x0.305: (0,0)
Pad_e2077
  round 0.711 hole 0.31x0.305: (0,0)
Pad_e2078
  round 0.711 hole 0.31x0.305: (0,0)
Pad_e2079
  round 0.711 hole 0.31x0.305: (0,0)
PDFN3333-8_L3.1-W3.2-P0.65-LS3.4-BL
  rect 0.4x0.75 smd: 1(-0.975,-1.534) 2(-0.325,-1.534) 3(0.325,-1.534) 4(0.975,-1.534)
  rect 0.4x0.8 smd: 5(0.975,1.534) 6(0.325,1.534) 7(-0.325,1.534) 8(-0.975,1.534)
  rect 2.6x2 smd: 9(-0.004,0.333)
PDFNWB-8L_L6.0-W5.0-P1.27-BL-EP_CON
  rect 3.048x1.321 smd: 1(-0.635,-2.857)
  rect 0.5x1.321 smd: 2(-0.635,-2.857) 3(0.635,-2.857) 4(1.905,-2.857) 6(0.635,2.857) 7(-0.635,2.857)
  rect 4.318x1.321 smd: 5(0,2.857)
  rect 4.318x3.5 smd: 8(0,0.812)
R0603_SMALL
  rect 0.806x0.864 smd: 1(-0.753,0) 2(0.753,0)
R2512
  rect 1.282x3.456 smd: 1(-3.067,0) 2(3.067,0)
SOD-323_L1.8-W1.3-LS2.5-RD
  rect 1x0.75 smd: 1(-1.173,0) 2(1.173,0)
SOIC-8_L4.9-W3.9-P1.27-LS6.0-BL
  oval 0.588x2.045 smd: 1(-1.905,-2.772) 2(-0.635,-2.772) 3(0.635,-2.772) 4(1.905,-2.772) 5(1.905,2.772) 6(0.635,2.772) 7(-0.635,2.772) 8(-1.905,2.772)
SOT-23-6_L2.9-W1.6-P0.95-LS2.8-BL
  rect 0.532x1.072 smd: 1(-0.95,-1.149) 2(0,-1.149) 3(0.95,-1.149) 4(0.95,1.149) 5(0,1.149) 6(-0.95,1.149)
SOT-23-6_L2.9-W1.6-P0.95-LS2.8-BR
  rect 1x0.55 smd: 1(1.4,-0.95) 2(1.4,0) 3(1.4,0.95) 4(-1.4,0.95) 5(-1.4,0) 6(-1.4,-0.95)
TESTPOINT 1.6MM
  round 1.2 smd: 1(0,0)
TSSOP-20_L6.5-W4.4-P0.65-LS6.4-BL
  oval 0.364x1.742 smd: 1(-2.925,-2.871) 2(-2.275,-2.871) 3(-1.625,-2.871) 4(-0.975,-2.871) 5(-0.325,-2.871) 6(0.325,-2.871) 7(0.975,-2.871) 8(1.625,-2.871) 9(2.275,-2.871) 10(2.925,-2.871) 11(2.925,2.871) 12(2.275,2.871) 13(1.625,2.871) 14(0.975,2.871) 15(0.325,2.871) 16(-0.325,2.871) 17(-0.975,2.871) 18(-1.625,2.871) 19(-2.275,2.871) 20(-2.925,2.871)

## Nets
As in the schematic, except:
GND: C2.2 C4.1 C5.1 C9.1 C20.1 C27.1 C30.2 D7.2 LED2.1 NOREF#2. NOREF#4. NOREF#6. NOREF#12. NOREF#16. NOREF#17. NOREF#20. NOREF#28. NOREF#41. NOREF#45. NOREF#46. NOREF#62. NOREF#70. NOREF#82. NOREF#86. NOREF#96. NOREF#101. NOREF#106. NOREF#112. NOREF#131. NOREF#132. NOREF#135. NOREF#148. NOREF#154. NOREF#155. NOREF#164. NOREF#185. NOREF#204. NOREF#205. NOREF#210. NOREF#214. NOREF#219. NOREF#225. NOREF#230. NOREF#234. NOREF#259. NOREF#264. NOREF#267. NOREF#275. NOREF#283. R8.2 R25.2 R26.2 R61.2 U1.8 U14.2 U15.2 U19.1 U20.4
PGND: C8.1 C25.1 C28.1 C31.1 C32.1 C33.1 C34.1 C35.1 C36.1 NOREF#3. NOREF#9. NOREF#11. NOREF#13. NOREF#15. NOREF#18. NOREF#23. NOREF#24. NOREF#29. NOREF#31. NOREF#33. NOREF#36. NOREF#37. NOREF#38. NOREF#40. NOREF#43. NOREF#48. NOREF#54. NOREF#58. NOREF#63. NOREF#66. NOREF#67. NOREF#68. NOREF#69. NOREF#71. NOREF#72. NOREF#74. NOREF#75. NOREF#78. NOREF#79. NOREF#81. NOREF#87. NOREF#88. NOREF#89. NOREF#91. NOREF#94. NOREF#95. NOREF#97. NOREF#100. NOREF#102. NOREF#105. NOREF#107. NOREF#108. NOREF#109. NOREF#110. NOREF#113. NOREF#114. NOREF#115. NOREF#116. NOREF#118. NOREF#119. NOREF#120. NOREF#122. NOREF#123. NOREF#127. NOREF#128. NOREF#130.21 NOREF#133. NOREF#137. NOREF#140. NOREF#141. NOREF#142. NOREF#146. NOREF#149. NOREF#150. NOREF#151. NOREF#152.5 NOREF#153. NOREF#159. NOREF#160. NOREF#161. NOREF#165. NOREF#167. NOREF#168. NOREF#169. NOREF#171. NOREF#172. NOREF#173. NOREF#174. NOREF#175. NOREF#177. NOREF#178. NOREF#183. NOREF#191. NOREF#193. NOREF#195. NOREF#197. NOREF#199. NOREF#200. NOREF#201. NOREF#211. NOREF#212. NOREF#213. NOREF#218. NOREF#220. NOREF#221. NOREF#222. NOREF#227. NOREF#228. NOREF#229. NOREF#232. NOREF#238. NOREF#240. NOREF#245. NOREF#246. NOREF#247. NOREF#249. NOREF#250. NOREF#253. NOREF#254. NOREF#258. NOREF#260. NOREF#261. NOREF#265. NOREF#266. NOREF#270. NOREF#271. NOREF#273. NOREF#274. NOREF#276. NOREF#277. NOREF#279. NOREF#280. NOREF#282. NOREF#284. NOREF#285. NOREF#286. NOREF#288. NOREF#289. Q16.1 Q16.2 Q16.3 R2.1 R3.1 R14.1 R61.1 U19.9 U19.13 U19.17
DCBUS: C8.2 C25.2 C27.2 C28.2 C31.2 C32.2 C33.2 C34.2 C35.2 C36.2 NOREF#5. NOREF#7. NOREF#8. NOREF#21. NOREF#22. NOREF#25. NOREF#26. NOREF#27. NOREF#30. NOREF#32. NOREF#34. NOREF#35. NOREF#39. NOREF#42. NOREF#44. NOREF#50. NOREF#51. NOREF#52. NOREF#53. NOREF#55. NOREF#56. NOREF#64. NOREF#65. NOREF#73. NOREF#76. NOREF#80. NOREF#84. NOREF#85. NOREF#90. NOREF#92. NOREF#93. NOREF#98. NOREF#99. NOREF#104. NOREF#121. NOREF#124. NOREF#125. NOREF#139. NOREF#143.21 NOREF#163. NOREF#170. NOREF#176. NOREF#179. NOREF#181. NOREF#182. NOREF#188. NOREF#189. NOREF#190. NOREF#192. NOREF#194. NOREF#196. NOREF#198. NOREF#202. NOREF#203. NOREF#207. NOREF#208. NOREF#215. NOREF#224. NOREF#236. NOREF#239. NOREF#242. NOREF#244. NOREF#248. NOREF#251. NOREF#252. NOREF#255. NOREF#256. NOREF#257. NOREF#262. NOREF#263. NOREF#268. NOREF#269. NOREF#287. Q7.5 Q7.6 Q7.7 Q7.8 Q8.5 Q8.6 Q8.7 Q8.8 Q9.5 Q9.6 Q9.7 Q9.8 Q15.5 Q15.6 Q15.7 Q15.8 Q15.9 R1.1 R29.1 U15.5
M0_SH_A: C3.1 NOREF#14. NOREF#49. NOREF#77. NOREF#129. NOREF#136. NOREF#147. NOREF#156. NOREF#157. NOREF#158. NOREF#162. NOREF#231.21 NOREF#235. NOREF#241. NOREF#278. Q7.1 Q7.2 Q7.3 Q10.5 Q10.6 Q10.7 Q10.8 U1.12
M0_SH_B: C12.1 NOREF#47. NOREF#59. NOREF#60.21 NOREF#103. NOREF#111. NOREF#126. NOREF#144. NOREF#145. NOREF#166. NOREF#180. NOREF#186. NOREF#206. NOREF#226. NOREF#281. Q8.1 Q8.2 Q8.3 Q11.5 Q11.6 Q11.7 Q11.8 U1.15
M0_SH_C: C11.1 NOREF. NOREF#10. NOREF#83. NOREF#117. NOREF#138. NOREF#184. NOREF#209.21 NOREF#216. NOREF#217. NOREF#223. NOREF#233. NOREF#237. NOREF#243. NOREF#272. Q9.1 Q9.2 Q9.3 Q12.5 Q12.6 Q12.7 Q12.8 U1.18
$1N6972: C29.1 NOREF#134.5 Q15.1 Q15.2 Q15.3 Q16.5 Q16.6 Q16.7 Q16.8 Q16.9 U20.6

Pads without a net: NOREF#19 1; NOREF#57 1; NOREF#61 1; NOREF#187 1; U14 6; U15 1

## Via types
v1: diameter 0.61, hole 0.305, Top Layer to Bottom Layer, 36 vias

## Routing (per net, layer and track width the routed paths; a pad name or vN(x,y) marks a point on that pad's centre or on a via; arc(x,y) is an arc through that point)
5V: length 27.7
  Top Layer w0.152: R6.1 7.76,1.88 8.76,2.88 11.3,2.88 12.11,3.69 U19.4
  Top Layer w0.254: U19.4 12.11,4.62 10.29,6.44 10.29,8.47 11.18,9.36 11.18,11.77 C5.2
  Top Layer w0.305: C5.2 9.91,13.36 ; 9.91,13.36 R28.1 ; 9.91,13.36 U14.5 12.4,13.36 12.95,12.8 12.95,11.52 12.11,10.67 L1.1 ; R27.1 7.87,14.44 C20.2
  Top Layer w0.508: C20.2 C5.2
GND: length 2.9
  Top Layer w0.152: 35.43,7.46 v1(35.43,7.46) C30.2
  Top Layer w0.305: R61.2 v1(5.3,20.93) v1(6.22,20.93)
  vias: v1(1.78,11.14) v1(1.78,9.23) v1(2.41,11.13) v1(2.41,9.23)
PGND: length 106.9
  Top Layer w0.152: 6.9,25.29 7.15,25.53 8.63,25.53 8.99,25.18 8.99,21.66 v1(8.64,21.3) ; 17.82,22.41 17.82,25.29 ; 28.76,22.42 28.76,25.3 29.08,25.62 30.23,25.62 30.92,24.93 30.92,21.74 v1(30.48,21.31) 30.48,21.3 ; 17.82,25.29 18.07,25.54 19.38,25.54 19.91,25.01 19.91,21.68 19.56,21.32 v1(19.56,21.3) ; 6.9,22.41 6.9,25.29
  Top Layer w0.305: R61.1 6.61,22.43 R2.1
  Bottom Layer w0.152: v1(8.64,21.3) 10.92,19.01 19.18,19.01 20.83,17.36 20.83,2.63 U19.9 ; U19.13 25.91,2.63 25.91,14.95 v1(19.56,21.3) ; v1(30.48,21.31) 31.14,20.65 31.14,2.53 30.14,1.53 U19.17
  Bottom Layer w0.508: NOREF#152.5 38.26,26.22 36.45,26.22
  vias: v1(38.23,30.8) v1(38.22,30.15) v1(38.22,29.5) v1(38.22,28.85)
VCC: length 45.8
  Top Layer w0.152: v1(2.79,34) 2.81,34.01 TP6.1 4.25,35.2 RT1.2
  Bottom Layer w0.152: U19.5 13.55,2.63 6.48,2.63 0.89,8.22 0.89,32.09 v1(2.79,34)
AUX_H: length 12.3
  Top Layer w0.152: U19.18 29.89,5.47 31.12,6.69 36.58,6.69 37.59,7.71 U20.2
AUX_L: length 10.9
  Top Layer w0.152: U20.3 38.86,7.84 37.21,6.19 33.27,6.19 32.43,5.34 U19.20
DCBUS: length 47.7
  Top Layer w0.152: 1.27,13.17 1.14,13.17 0.38,12.41 0.38,7.2 0.89,6.69 4.44,6.69 4.96,7.21 R1.1 ; Q7.5 Q7.7
  Top Layer w0.305: R29.1 1.52,14.44 C27.2 ; C27.2 1.27,13.17 0.51,13.93 0.51,30.7 2.16,32.35 11.86,32.35 Q9.8 ; C27.2 1.78,13.42 U15.5
M0_GH_A: length 9.4
  Top Layer w0.152: R7.1 35.18,20.41 34.16,19.39 32.38,19.39 30.86,17.87 30.86,15.78 30.84,15.75
M0_GH_B: length 9.5
  Top Layer w0.152: 28.88,15.75 28.88,17.31 26.67,19.52 25.12,19.52 24.38,20.25 R19.1
M0_GH_C: length 17.2
  Top Layer w0.152: 26.94,15.75 26.94,17.22 25.78,18.38 17.4,18.38 13.46,22.32 13.46,22.45
M0_GL_A: length 15.9
  Top Layer w0.152: v1(30.23,17.23) 30.23,17.87 32.26,19.9 33.4,19.9 33.91,20.41 R11.1 ; v1(30.23,11.77) 30.73,11.77 31.49,11.02 U1.9
  Bottom Layer w0.152: v1(30.23,11.77) 30.86,12.41 30.86,16.6 v1(30.23,17.23)
M0_GL_B: length 17.7
  Top Layer w0.152: R22.1 23.11,20.54 24.51,19.14 26.42,19.14 28.19,17.36 v1(28.19,17.23) ; U1.10 32.13,11.39 30.86,12.66 v1(30.23,12.66)
  Bottom Layer w0.152: v1(30.23,12.66) 28.19,14.69 v1(28.19,17.23)
M0_GL_C: length 29
  Top Layer w0.152: v1(26.8,12.16) 29,12.16 31.16,14.31 31.62,14.31 32.13,14.83 32.13,15.75 ; v1(26.16,17.23) 25.4,18 16.38,18 12.08,22.3 12.08,22.46
  Bottom Layer w0.152: v1(26.16,17.23) 26.8,16.6 v1(26.8,12.16)
M0_SH_A: length 42.1
  Top Layer w0.152: Q7.1 36.26,36.98 37.59,35.65 37.59,22.31 34.29,19.01 32.77,19.01 31.49,17.73 31.49,15.04 29.11,12.66 26.54,12.66 25.43,11.55 23.69,11.55 23.37,11.23 23.37,11.01 22.35,10 19.57,10 C3.1
M0_SH_B: length 37.9
  Top Layer w0.152: Q8.1 25.21,36.98 26.7,35.5 26.7,25.26 26.29,24.86 26.29,20.66 29.53,17.42 29.53,15.75 29.59,15.69 29.59,13.93 28.96,13.3 26.39,13.3 25.19,12.1 19.49,12.1 C12.1
M0_SH_C: length 43.4
  Top Layer w0.152: Q9.1 14.29,36.98 15.75,35.52 15.75,25.21 15.49,24.96 15.49,21.05 17.78,18.76 26.16,18.76 27.59,17.34 27.59,15.75 27.69,15.65 27.69,14.44 27.31,14.06 19.69,14.06 C11.1
M0_SP_A: length 29.6
  Top Layer w0.152: 28.7,28.86 28.69,26.4 29.2,25.9 30.34,25.9 31.24,25 31.24,21.5 v1(31.44,21.3)
  Bottom Layer w0.152: v1(31.44,21.3) 31.42,21.28 31.42,2.54 U19.19
M0_SP_B: length 32.1
  Top Layer w0.152: 17.81,28.85 17.82,26.17 18.08,25.92 19.47,25.92 20.23,25.15 20.23,21.68 20.57,21.34 v1(20.57,21.3)
  Bottom Layer w0.152: U19.15 26.29,2.59 26.29,15.58 v1(20.57,21.3)
M0_SP_C: length 39.1
  Top Layer w0.152: v1(9.65,21.3) 9.31,21.64 9.31,25.25 8.65,25.91 7.15,25.91 6.9,26.17 6.89,28.85
  Bottom Layer w0.152: U19.11 22.27,1.57 21.21,2.63 21.21,17.49 19.18,19.52 11.43,19.52 v1(9.65,21.3)
M0_VB_A: length 12.9
  Top Layer w0.152: 21.88,10.76 21.97,10.76 23.04,11.83 25.31,11.83 26.43,12.94 29,12.94 29.97,13.92 29.97,14.59 30.19,14.8 30.19,15.75
  Top Layer w0.305: C3.2 21.88,10.76
M0_VB_B: length 10
  Top Layer w0.152: 28.24,15.75 28.24,14.36 27.56,13.68 22.77,13.68 21.88,12.79 C12.2
M0_VB_C: length 6.5
  Top Layer w0.152: C11.2 21.88,14.95 22.89,15.97 26.07,15.97 26.28,15.75
PWMA_H: length 11.1
  Top Layer w0.152: U1.3 27.59,8.62 25.02,6.06 21.72,6.06 U19.10
PWMA_L: length 6.8
  Top Layer w0.152: U19.16 29.53,6.25 U1.6
PWMB_H: length 13.1
  Top Layer w0.152: U19.8 19.56,6.44 24.89,6.44 26.94,8.48 U1.2
PWMB_L: length 7.6
  Top Layer w0.152: U19.14 28.88,8.14 28.88,10.01
PWMC_H: length 15
  Top Layer w0.152: U1.1 26.28,8.47 24.76,6.95 17.53,6.95 U19.6
PWMC_L: length 9.2
  Top Layer w0.152: U1.4 28.24,8.64 25.27,5.68 23.88,5.68 U19.12
TEMP_1: length 42.6
  Top Layer w0.152: TP5.1 v1(1.11,34)
  Bottom Layer w0.152: U19.3 12.11,1.41 11.18,0.47 8.13,0.47 0.51,8.09 0.51,33.4 v1(1.11,34)
TEMP_2: length 45.7
  Top Layer w0.152: RT1.1 4.18,33.49 v1(3.43,33.49)
  Bottom Layer w0.152: v1(3.43,33.49) 1.27,31.33 1.27,8.34 6.6,3.01 15.71,3.01 U19.7
V_BUS: length 10.2
  Top Layer w0.152: C9.2 9.57,7.91 U19.2 ; R8.1 v1(11.19,7.2) ; R1.2 v1(6.47,7.2)
  Bottom Layer w0.152: v1(11.19,7.2) v1(9.55,7.2) v1(6.47,7.2)
VGS: length 40.1
  Top Layer w0.152: 36.33,8.09 36.32,8.1 U20.1 35.98,9.68 D8.1 34.41,9.56 33.95,9.11 33.95,8.01 33.15,7.2 31.12,7.2 C2.1 30.19,8.14 U1.7 30.19,10.96 29.88,11.27 24.73,11.27 v1(24.22,10.76)
  Top Layer w0.305: 17.27,9.74 17.27,9.49 22.95,9.49 v1(24.22,10.76) ; 17.27,9.74 C4.2 ; 17.27,9.74 17.78,10.25 17.78,13.81 17.14,14.45 R5.1
  Top Layer w0.508: C4.2 16.67,9.46 D6.1
  Bottom Layer w0.305: v1(24.22,10.76) 24.26,10.79 v1(24.26,14.95)
  vias: v1(24.22,12.8)
$1N2378: length 9.4
  Top Layer w0.152: Q12.4 9.14,31.14 9.14,25.81 10.1,24.86 11.56,24.86 12.08,24.33 12.08,23.96
$1N2381: length 9.7
  Top Layer w0.152: Q11.4 20.07,31.14 20.07,25.71 20.79,24.98 22.61,24.98 23.11,24.47 R22.2
$1N2384: length 18.4
  Top Layer w0.152: Q7.4 32.89,36.86 32.89,36.03 33.27,35.65 36.58,35.65 37.31,34.92 37.31,25.59 36.7,24.98 35.81,24.98 35.18,24.35 R7.2
$1N2446: length 9.4
  Top Layer w0.152: Q10.4 30.99,31.14 30.99,25.74 31.75,24.98 33.02,24.98 33.91,24.09 R11.2
$1N2450: length 18.4
  Top Layer w0.152: Q8.4 21.84,36.16 22.22,35.78 25.91,35.78 26.42,35.27 26.42,25.62 25.78,24.98 24.89,24.98 24.38,24.47 R19.2
$1N2453: length 18.3
  Top Layer w0.152: 13.46,23.96 13.46,24.47 13.97,24.98 15.11,24.98 15.47,25.34 15.47,34.91 14.86,35.52 11.56,35.52 10.92,36.16 Q9.4
$1N2498: length 2.6
  Top Layer w0.305: R29.2 3.09,14.37 U15.4
$1N2502: length 4.1
  Top Layer w0.508: U15.3 5.5,14.67 R26.1 7.85,15.96 R27.2
$1N2507: length 2.5
  Top Layer w0.305: U14.4 10.1,15.96 R28.2
$1N4147: length 17.3
  Top Layer w0.152: R62.2 v1(38.1,21.05) ; Q15.4 v1(41.28,34.63)
  Bottom Layer w0.152: v1(41.28,34.63) 41.28,22.58 39.75,21.05 v1(38.1,21.05)
$1N4272: length 6.8
  Top Layer w0.152: D8.2 C29.2 33.53,14.28 33.53,15.46 33.9,15.83 36.07,15.83 U20.8
$1N4301: length 3.4
  Top Layer w0.152: R62.1 37.59,18.26 U20.7
$1N4305: length 3.4
  Top Layer w0.152: 39.62,18.83 40.13,18.32 40.13,15.69
$1N4309: length 9
  Top Layer w0.152: v1(38.48,22.57) 37.87,23.18 37.87,27.72 Q16.4 ; v1(39.62,22.06) R63.2
  Bottom Layer w0.152: v1(39.62,22.06) 39.12,22.57 v1(38.48,22.57)
$1N6972: length 24
  Top Layer w0.152: C29.1 35.51,13.81 38.1,13.81 38.86,14.57 U20.6 38.86,22.2 39.75,23.08 39.75,28.72 Q16.9
  Top Layer w0.508: NOREF#134.5 40.51,28.62 Q16.9
$1N14196: length 1.3
  Top Layer w0.152: LED2.2 7.24,3.39 R6.2

## Copper pours and planes (outline as drawn; the poured copper is in the pictures)
5V on Top Layer: 7.11,13.42 8.64,13.42 8.64,12.66 6.48,10.5 6.48,9.23 5.21,9.23 5.21,11.39 5.84,11.39 7.11,12.66
GND on Top Layer: -2.67,21.43 43.43,21.43 43.43,-1.69 -2.67,-1.69
GND on Bottom Layer: -3.43,21.43 44.58,21.43 44.58,-3.97 -3.43,-3.97
PGND on Top Layer: 15.92,25 19.67,25 19.67,22 15.92,22
PGND on Top Layer: 31.37,27.78 36.96,27.78 36.96,25.87 31.37,25.87
PGND on Top Layer: 5,25 8.75,25 8.75,22 5,22
PGND on Top Layer: 37.85,30.8 38.61,30.8 38.61,28.51 37.87,28.51 37.85,28.54 37.85,30.79
PGND on Top Layer: 20.45,27.78 26.03,27.78 26.03,25.87 20.45,25.87
PGND on Top Layer: 26.88,25.03 30.63,25.03 30.63,22.03 26.88,22.03
PGND on Top Layer: 9.53,27.78 15.11,27.78 15.11,25.87 9.53,25.87
PGND on Bottom Layer: 17.15,41.75 12.07,41.75 12.07,38.19 11.56,37.68 5.07,37.68 5.07,22.08 30.53,21.96 30.53,25.08 31.19,25.74 36.96,25.74 36.96,27.84 9.37,27.84 9.27,34.68 10.16,35.57 14.75,35.57 17.11,37.93
PGND on Bottom Layer: 37.85,30.8 38.61,30.8 38.61,27.31 36.88,25.81 36.88,27.84 37.84,28.53 37.84,28.58 37.85,28.59
DCBUS on Top Layer: 31.37,29.01 31.37,29.77 32.54,30.94 32.54,32.44 36.81,32.44 36.81,28.92 31.45,28.92
DCBUS on Top Layer: 1.02,14.82 2.03,14.82 2.03,14.57 2.92,13.68 4.06,13.68 4.06,13.04 2.54,13.04 2.29,12.79 0.76,12.79 0.76,13.56 1.02,13.82
DCBUS on Top Layer: 20.45,29.01 20.45,29.77 21.61,30.94 21.61,32.44 25.88,32.44 25.88,28.92 20.53,28.92
DCBUS on Top Layer: 9.53,28.92 9.53,29.68 10.69,30.85 10.69,32.35 14.96,32.35 14.96,28.83 9.61,28.83
DCBUS on Bottom Layer: 24.64,41.62 28.19,41.62 28.19,37.68 31.09,37.68 32.48,36.28 36.83,36.28 36.83,30.57 10.67,30.57 10.67,35.02 14.99,35.02 17.65,37.68 24.64,37.68
DCBUS on Bottom Layer: 40.42,34.28 40.42,31.59 35.31,31.59 35.18,31.71 35.18,34.02 36.47,34.02 36.7,34.25 40.39,34.25
M0_SH_A on Top Layer: 27.05,33.24 31.37,33.24 31.37,36.28 36.83,36.28 36.83,41.75 27.05,41.75
M0_SH_B on Top Layer: 16.13,33.24 20.45,33.24 20.45,36.28 25.91,36.28 25.91,41.62 26.03,41.75 16.13,41.75
M0_SH_C on Top Layer: 5.21,33.24 9.52,33.24 9.52,36.28 14.99,36.28 14.99,41.62 15.11,41.75 5.21,41.75
M0_SP_A on Top Layer: 27.05,31.97 30.1,31.97 30.1,29.68 30.1,29.68 30.43,29.35 30.43,28.27 30.33,28.17 27.05,28.17
M0_SP_B on Top Layer: 16.13,31.97 19.18,31.97 19.18,29.68 19.18,29.68 19.51,29.35 19.51,28.27 19.41,28.17 16.13,28.17
M0_SP_C on Top Layer: 5.21,31.97 8.25,31.97 8.25,29.68 8.59,29.35 8.59,28.27 8.49,28.17 5.21,28.17
$1N2500 on Top Layer: 4.06,12.79 4.06,11.65 4.32,11.39 4.32,8.73 3.94,8.34 3.94,7.6 2.98,7.6 2.98,12.79
$1N2509 on Top Layer: 13.46,16.35 16.76,16.35 16.76,15.58 16.13,15.58 15.11,14.57 15.11,14.06 14.1,14.06 14.1,14.95 13.46,15.58
$1N2515 on Top Layer: 14.1,12.66 15.11,12.66 15.11,9.36 14.86,9.11 14.86,7.58 13.84,7.58 13.84,8.85 13.59,9.11 13.59,11.27 14.05,11.72 14.05,12.61
$1N6972 on Top Layer: 40.89,33.49 41.66,33.49 41.66,27.78 38.99,27.78 38.99,30.32 39.37,30.7 40,30.7 40.89,31.59

Small or netless copper shapes (teardrops, artwork), in the pictures only: 200 on Top Layer, 34 on Bottom Layer

## Text on the board
Top Silkscreen Layer: JLCJLCJLCJLC
